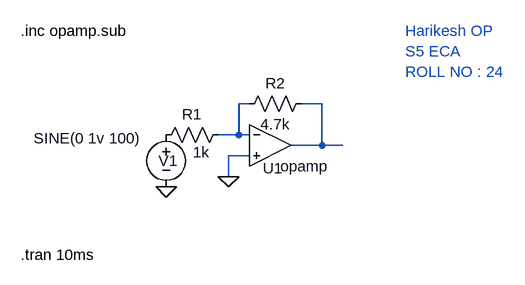
[diagram p0: schematic INVERTING_AMP.asc]
INVERTING_AMP.asc, the LTspice schematic file:
Version 4
SHEET 1 880 680
WIRE 192 80 176 80
WIRE 304 80 272 80
WIRE 176 128 176 80
WIRE 176 128 144 128
WIRE 192 128 176 128
WIRE 304 144 304 80
WIRE 304 144 256 144
WIRE 336 144 304 144
WIRE 192 160 160 160
WIRE 160 192 160 160
FLAG 64 208 0
FLAG 160 192 0
SYMBOL OpAmps\\opamp 224 80 R0
WINDOW 0 -11 99 Left 2
SYMATTR InstName U1
SYMBOL res 160 112 R90
WINDOW 0 0 56 VBottom 2
WINDOW 3 27 42 VTop 2
SYMATTR InstName R1
SYMATTR Value 1k
SYMBOL voltage 64 112 R0
WINDOW 123 0 0 Left 0
WINDOW 39 0 0 Left 0
WINDOW 0 -12 56 Left 2
WINDOW 3 -204 21 Left 2
SYMATTR InstName V1
SYMATTR Value SINE(0 1v 100)
SYMBOL res 288 64 R90
WINDOW 0 0 56 VBottom 2
WINDOW 3 32 56 VTop 2
SYMATTR InstName R2
SYMATTR Value 4.7k
TEXT -160 -32 Left 2 !.inc opamp.sub
TEXT 432 -32 Left 2 ;Harikesh OP\nS5 ECA \nROLL NO : 24
TEXT -160 312 Left 2 !.tran 10ms

The netlist it stands for:
* INVERTING_AMP.asc
XU1 N001 0 N002 opamp Aol=100K GBW=10Meg  ; pins invin noninvin out
R1 N001 P001 1k
V1 P001 0 SINE(0 1v 100)
R2 N002 N001 4.7k
.inc opamp.sub
* Harikesh OP
* S5 ECA
* ROLL NO : 24
.tran 10ms
.backanno
.end